# EasyEDA Pro project ProProject_Hauptplatine_ESP32.epro, board PCB1
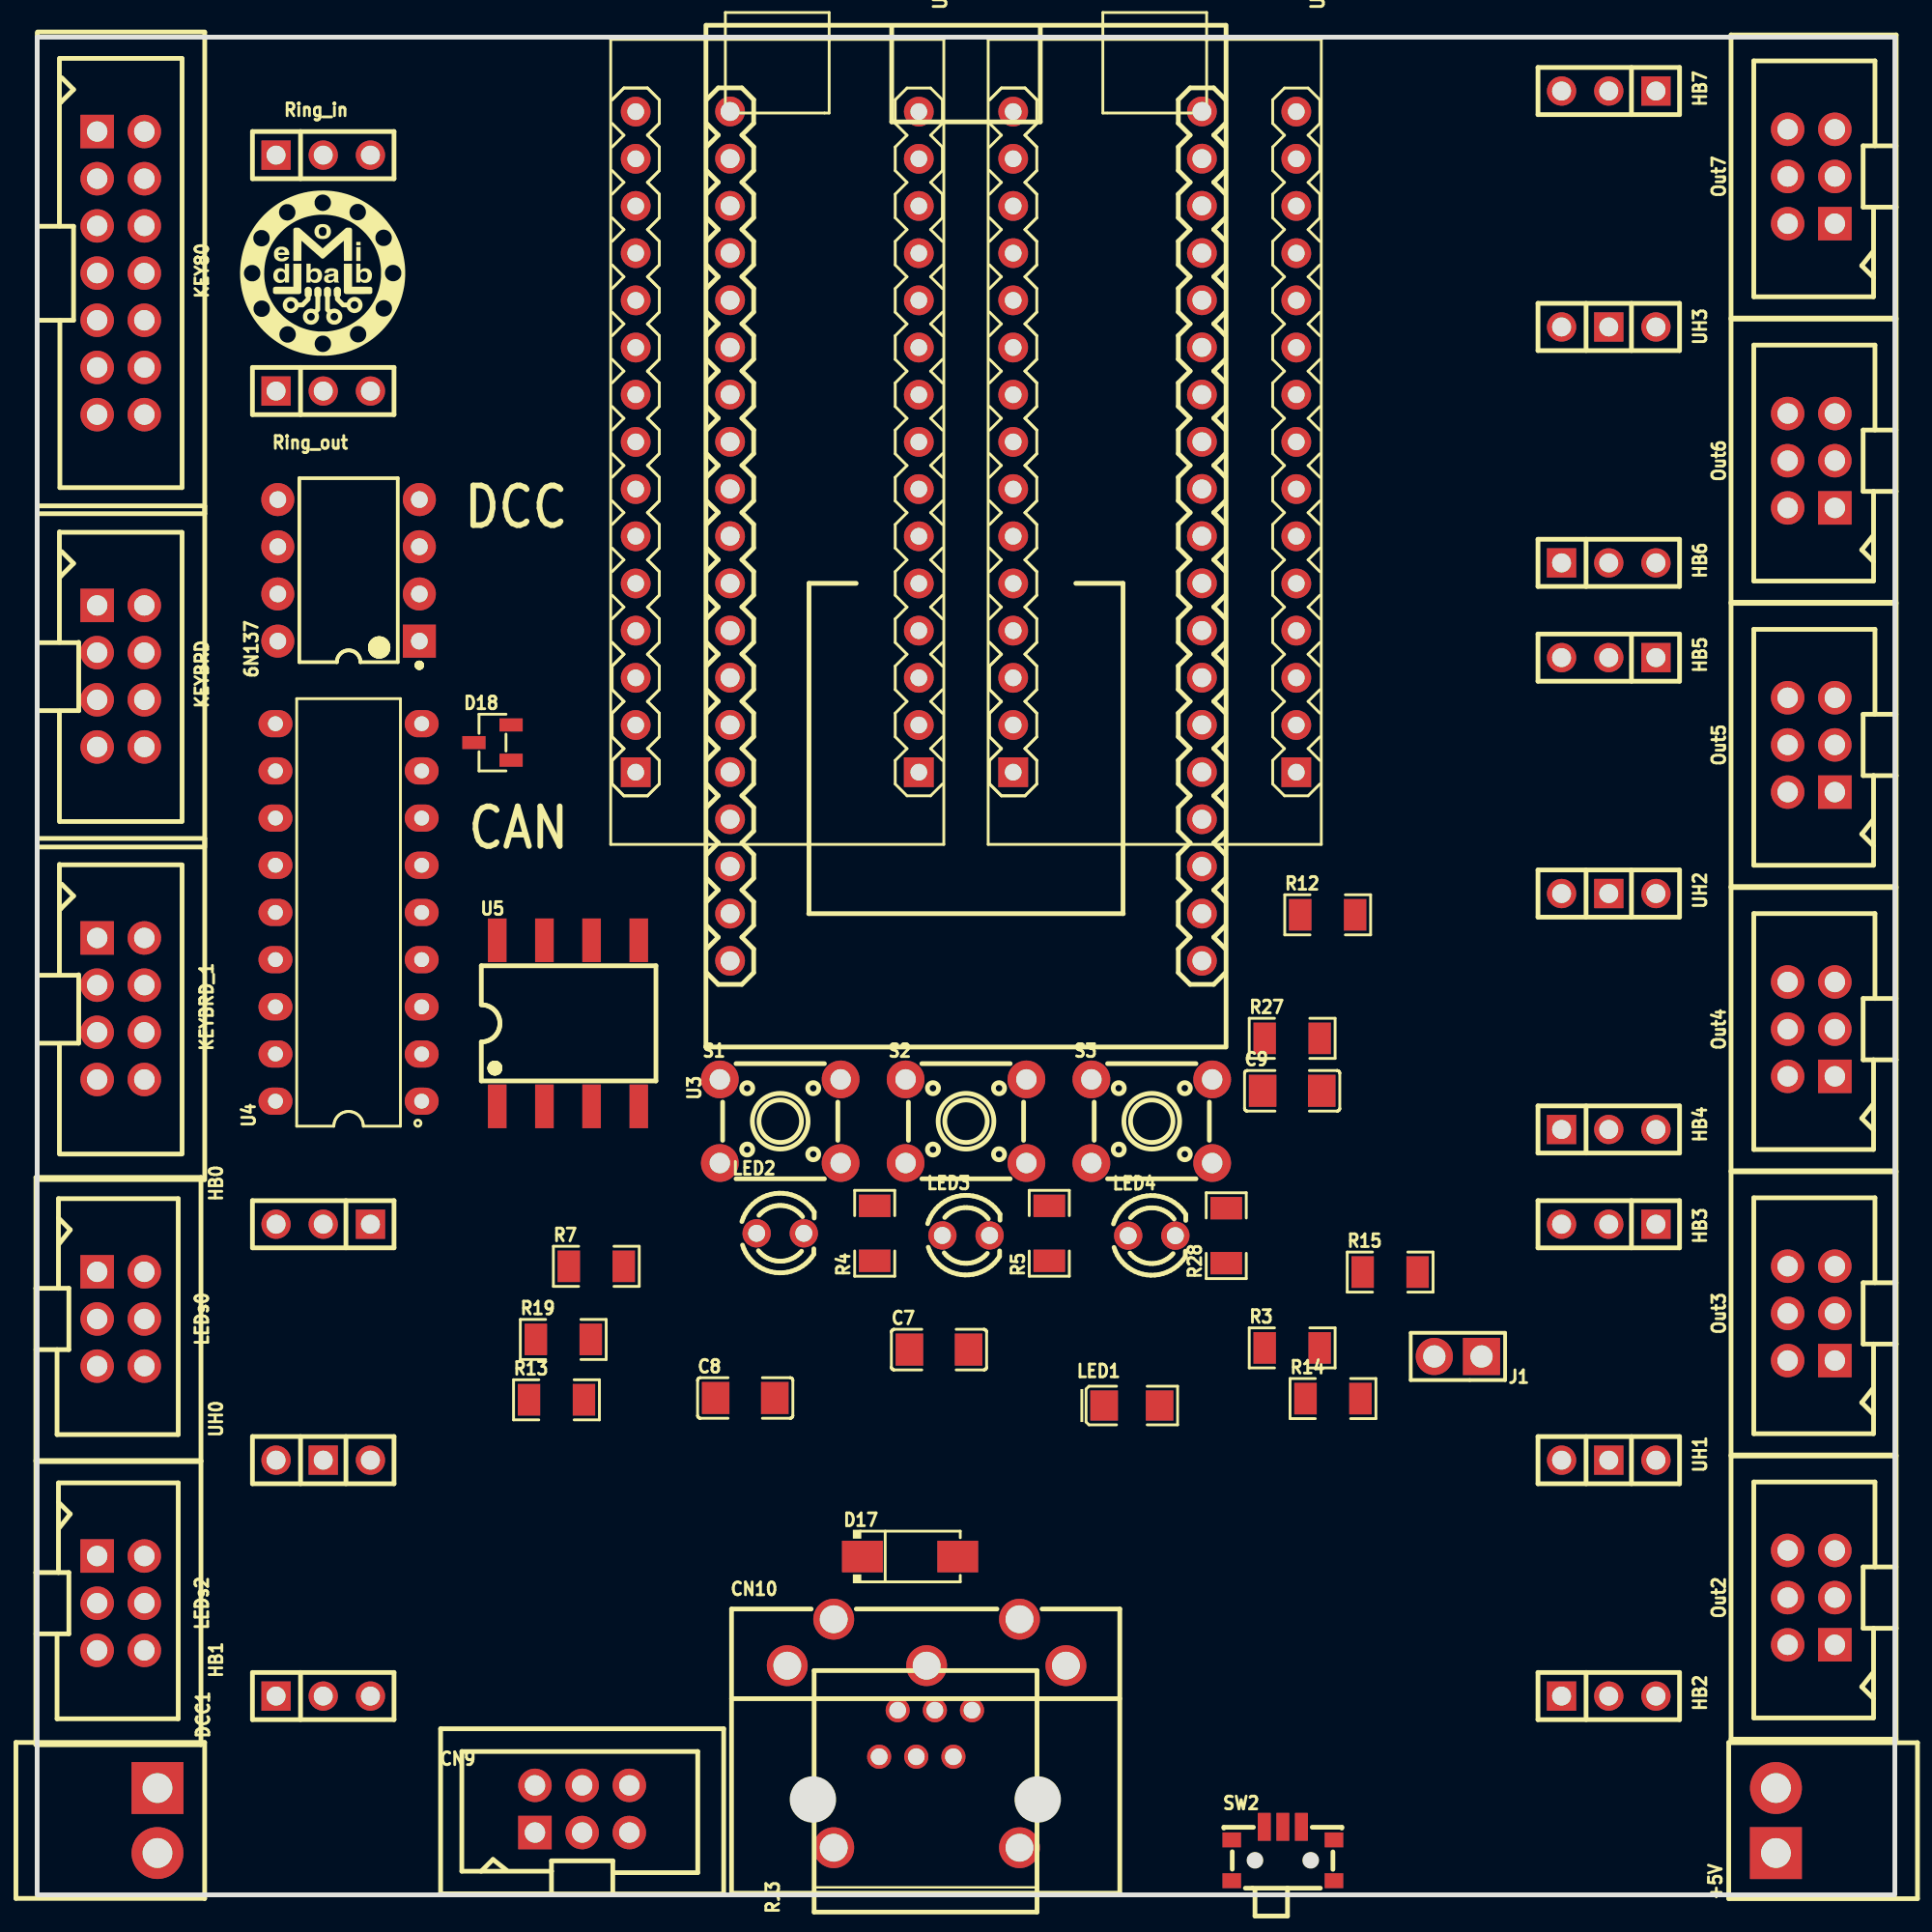
[diagram p12: board, top side]
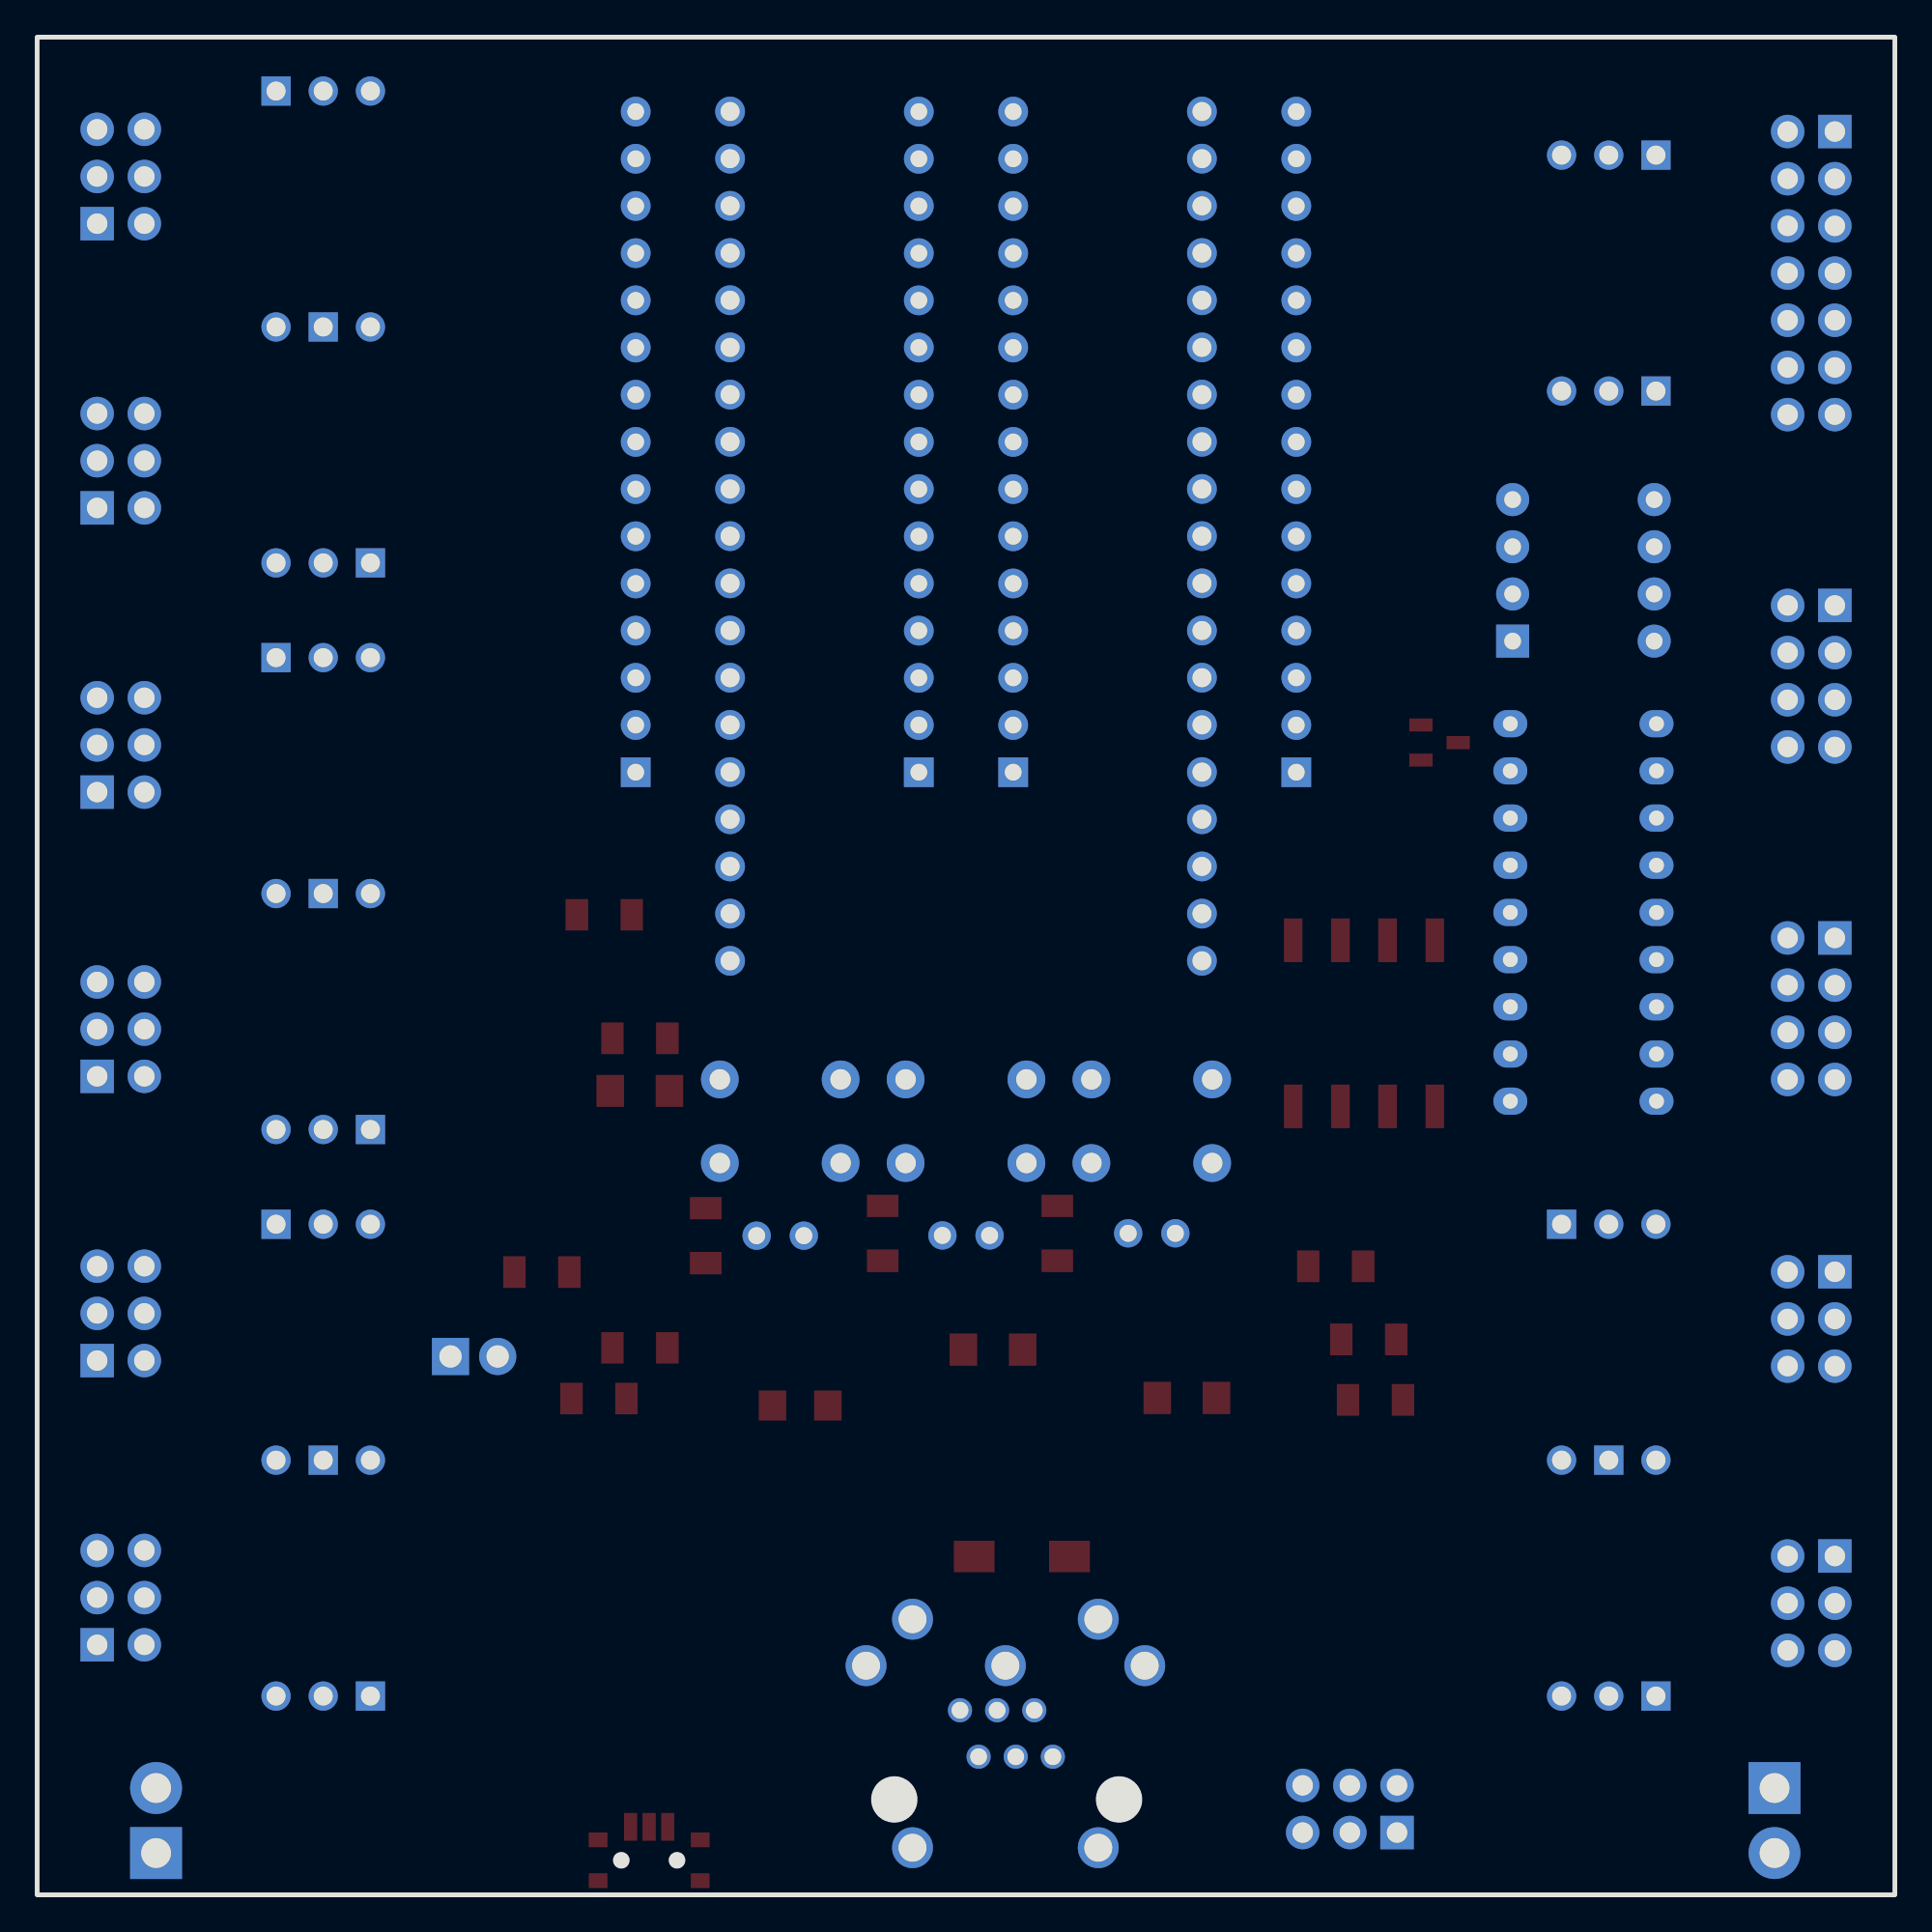
[diagram p13: board, bottom side, seen from below]

Outline 100 x 100 mm; copper layers: Top Layer, Bottom Layer. Coordinates in mm from the lower left corner of the outline.
Outline path: rectangle 0,100 100,0
Stack: Top Layer 0.035mm / Dielectric1 1.51mm FR4 er 4.5 / Bottom Layer 0.035mm

## Design rules (mm)
template: copperThickness1oz
spacing copperThickness1oz (default): track to track 0.132, other pairs 0.152 to 0.3
spacing copperThickness2oz: track to track 0.203, other pairs 0.152 to 0.3
track width copperThickness1oz (default): min 0.127, default 0.254, max 2.54
track width copperThickness2oz: min 0.203, default 0.254, max 2.54
differential pair differentialPair (default): width min 0.127, default 0.254, max 2.54; gap min 0.152, default 0.152
via viaSize (default): diameter min 0.5, default 0.61, max 10; hole min 0.3, default 0.305, max 6.299

## Placement (name value [footprint] x y rotation side)
6N137  6N137  [DIP-8_L9.8-W6.6-P2.54-LS7.6-BL]  16.76 71.3 90 top
+5V  DB2ERC-3.5-2P-GN  [CONN-TH_2P-P3.50_DB2ERC-3.5-2P]  93.6 4 90 top
C7  1uF  [C1206]  48.55 29.35 0 top
C8  1uF  [C1206]  38.12 26.75 0 top
C9  1uF  [C1206]  67.56 43.28 0 top
CN9  BH254V-6P  [IDC-TH_6P-P2.54-V-R2-C3-S2.54]  29.34 4.62 0 top
CN10  DIN-504B-M10  [CONN-TH_DIN-504B-M10]  47.88 8.69 0 top
D17  SS14  [SMA_L4.2-W2.6-LS5.3-RD]  46.99 18.21 0 top
D18  PESD2CAN,215  [SOT-23-3_L2.9-W1.3-P1.90-LS2.4-BR]  24.51 62.03 0 top
DCC1  DB2ERC-3.5-2P-GN  [CONN-TH_2P-P3.50_DB2ERC-3.5-2P]  6.48 4 270 top
HB0  PM2.54-1*3  [HDR-TH_3P-P2.54-V-F]  15.4 36.1 180 top
HB1  PM2.54-1*3  [HDR-TH_3P-P2.54-V-F]  15.4 10.7 0 top
HB2  PM2.54-1*3  [HDR-TH_3P-P2.54-V-F]  84.6 10.7 0 top
HB3  PM2.54-1*3  [HDR-TH_3P-P2.54-V-F]  84.6 36.1 180 top
HB4  PM2.54-1*3  [HDR-TH_3P-P2.54-V-F]  84.6 41.2 0 top
HB5  PM2.54-1*3  [HDR-TH_3P-P2.54-V-F]  84.6 66.6 180 top
HB6  PM2.54-1*3  [HDR-TH_3P-P2.54-V-F]  84.6 71.7 0 top
HB7  PM2.54-1*3  [HDR-TH_3P-P2.54-V-F]  84.6 97.1 180 top
J1  day/night  [HDR-TH_2P-P2.54-V-M]  76.48 28.98 180 top
KEY80  KEY80  [IDC-TH_14P-P2.54-V-R2-C7-S2.54]  4.5 87.3 270 top
KEYBRD  KEYBRD  [IDC-TH_8P-P2.54-V-R2-C4-S2.54]  4.5 65.6 270 top
KEYBRD_1  KEYBRD_1  [IDC-TH_8P-P2.54-V-R2-C4-S2.54]  4.5 47.7 270 top
LED1  Heartbeat  [LED1206-R-RD_GREEN]  58.93 26.34 0 top
LED2  y  [LED-TH_BD3.0-P2.54-FD]  40 35.61 0 top
LED3  w  [LED-TH_BD3.0-P2.54-FD]  50 35.5 0 top
LED4  b  [LED-TH_BD3.0-P2.54-FD]  60 35.48 0 top
LEDs0  BH254V-6P  [IDC-TH_6P-P2.54-V-R2-C3-S2.54]  4.5 31 270 top
LEDs2  BH254V-6P  [IDC-TH_6P-P2.54-V-R2-C3-S2.54]  4.5 15.7 270 top
Out2  BH254V-6P  [IDC-TH_6P-P2.54-V-R2-C3-S2.54]  95.5 16 90 top
Out3  BH254V-6P  [IDC-TH_6P-P2.54-V-R2-C3-S2.54]  95.5 31.3 90 top
Out4  BH254V-6P  [IDC-TH_6P-P2.54-V-R2-C3-S2.54]  95.5 46.6 90 top
Out5  BH254V-6P  [IDC-TH_6P-P2.54-V-R2-C3-S2.54]  95.5 61.9 90 top
Out6  BH254V-6P  [IDC-TH_6P-P2.54-V-R2-C3-S2.54]  95.5 77.2 90 top
Out7  BH254V-6P  [IDC-TH_6P-P2.54-V-R2-C3-S2.54]  95.5 92.5 90 top
R3  470Ω  [R1206]  67.56 29.44 0 top
R4  470Ω  [R1206]  45.09 35.61 90 top
R5  1kΩ  [R1206]  54.48 35.61 90 top
R7  4.7kΩ  [R1206]  30.1 33.83 0 top
R12  100Ω  [R1206]  69.47 52.76 0 top
R13  4.7kΩ  [R1206]  27.96 26.65 0 top
R14  22kΩ  [R1206]  69.75 26.71 0 top
R15  100Ω  [R1206]  72.83 33.52 0 top
R19  1kΩ  [R1206]  28.32 29.9 0 top
R27  22kΩ  [R1206]  67.56 46.11 0 top
R28  1kΩ  [R1206]  64.01 35.48 90 top
Ring_in  PM2.54-1*3  [HDR-TH_3P-P2.54-V-F]  15.4 93.65 0 top
Ring_out  PM2.54-1*3  [HDR-TH_3P-P2.54-V-F]  15.4 80.95 0 top
RJ3  DS1133-S60BPX  [RJ11-TH_DS1133-S60BPX]  47.82 8.69 90 top
S1  K2-1102DP-X4SW-04  [KEY-TH_4P-L6.2-W6.2-P4.50-LS6.5]  40 41.64 0 top
S2  K2-1102DP-X4SW-04  [KEY-TH_4P-L6.2-W6.2-P4.50-LS6.5]  50 41.64 0 top
S3  K2-1102DP-X4SW-04  [KEY-TH_4P-L6.2-W6.2-P4.50-LS6.5]  60 41.64 0 top
SW2  MINI MSK12CO2  [SW-SMD_MSK12CO2]  67.06 2.21 0 top
U1  ARDUINO_DCC  [COMM-TH_ARDUINO_NANO]  60.16 78.21 270 top
U2  ARDUINO_LED  [COMM-TH_ARDUINO_NANO]  39.84 78.21 270 top
U3  ESP32-DevKitC  [BULETM-SMD_ESP32-DEVKITC]  50 73.14 90 top
U4  MCP2515-I/P  [PDIP-18_L22.9-W6.4-P2.54-LS7.9-BL]  16.76 52.88 90 top
U5  ISO1050DUBR  [SOIC-8_L9.3-W6.6-P2.54-LS10.4-BL]  28.57 46.91 0 top
UH0  PM2.54-1*3  [hdr-th_3p-p2.54-v-f]  15.4 23.4 0 top
UH1  PM2.54-1*3  [hdr-th_3p-p2.54-v-f]  84.6 23.4 0 top
UH2  PM2.54-1*3  [hdr-th_3p-p2.54-v-f]  84.6 53.9 0 top
UH3  PM2.54-1*3  [hdr-th_3p-p2.54-v-f]  84.6 84.4 0 top

## Footprints (pads in the part's own frame, mm; a bottom-side part is the same pattern mirrored in y, then rotated)
BULETM-SMD_ESP32-DEVKITC
  round 1.6 hole 1.02: 1(-22.86,-12.7) 2(-20.32,-12.7) 3(-17.78,-12.7) 4(-15.24,-12.7) 5(-12.7,-12.7) 6(-10.16,-12.7) 7(-7.62,-12.7) 8(-5.08,-12.7) 9(-2.54,-12.7) 10(0,-12.7) 11(2.54,-12.7) 12(5.08,-12.7) 13(7.62,-12.7) 14(10.16,-12.7) 15(12.7,-12.7) 16(15.24,-12.7) 17(17.78,-12.7) 18(20.32,-12.7) 19(22.86,-12.7) 20(-22.86,12.7) 21(-20.32,12.7) 22(-17.78,12.7) 23(-15.24,12.7) 24(-12.7,12.7) 25(-10.16,12.7) 26(-7.62,12.7) 27(-5.08,12.7) 28(-2.54,12.7) 29(0,12.7) 30(2.54,12.7) 31(5.08,12.7) 32(7.62,12.7) 33(10.16,12.7) 34(12.7,12.7) 35(15.24,12.7) 36(17.78,12.7) 37(20.32,12.7) 38(22.86,12.7)
C1206
  rect 1.485x1.728 smd: 1(-1.593,0) 2(1.593,0)
COMM-TH_ARDUINO_NANO
  rect 1.6x1.6 hole 0.9: 1(17.78,7.62) 30(17.78,-7.62)
  round 1.6 hole 0.9: 2(15.24,7.62) 3(12.7,7.62) 4(10.16,7.62) 5(7.62,7.62) 6(5.08,7.62) 7(2.54,7.62) 8(0,7.62) 9(-2.54,7.62) 10(-5.08,7.62) 11(-7.62,7.62) 12(-10.16,7.62) 13(-12.7,7.62) 14(-15.24,7.62) 15(-17.78,7.62) 16(-17.78,-7.62) 17(-15.24,-7.62) 18(-12.7,-7.62) 19(-10.16,-7.62) 20(-7.62,-7.62) 21(-5.08,-7.62) 22(-2.54,-7.62) 23(0,-7.62) 24(2.54,-7.62) 25(5.08,-7.62) 26(7.62,-7.62) 27(10.16,-7.62) 28(12.7,-7.62) 29(15.24,-7.62)
CONN-TH_2P-P3.50_DB2ERC-3.5-2P
  round 2.794 hole 1.6: 1(1.75,0)
  rect 2.794x2.794 hole 1.6: 2(-1.75,0)
CONN-TH_DIN-504B-M10
  round 2.2 hole 1.5: 1(-7.5,3.65) 2(-5,6.15) 3(0,3.65) 4(5,6.15) 5(7.5,3.65) 6(-5,-6.15) 7(5,-6.15)
DIP-8_L9.8-W6.6-P2.54-LS7.6-BL
  rect 1.778x1.778 hole 0.9: 1(-3.81,-3.81)
  round 1.778 hole 0.9: 2(-1.27,-3.81) 3(1.27,-3.81) 4(3.81,-3.81) 5(3.81,3.81) 6(1.27,3.81) 7(-1.27,3.81) 8(-3.81,3.81)
HDR-TH_2P-P2.54-V-M
  rect 2x2 hole 1.2: 1(-1.27,0)
  round 2 hole 1.2: 2(1.27,0)
hdr-th_3p-p2.54-v-f
  round 1.575 hole 1.02: 1(-2.54,0) 3(2.54,0)
  rect 1.575x1.575 hole 1.02: 2(0,0)
HDR-TH_3P-P2.54-V-F
  rect 1.575x1.575 hole 1.02: 1(-2.54,0)
  round 1.575 hole 1.02: 2(0,0) 3(2.54,0)
IDC-TH_6P-P2.54-V-R2-C3-S2.54
  rect 1.8x1.8 hole 1.1: 1(-2.54,-1.27)
  round 1.8 hole 1.1: 2(-2.54,1.27) 3(0,-1.27) 4(0,1.27) 5(2.54,-1.27) 6(2.54,1.27)
IDC-TH_8P-P2.54-V-R2-C4-S2.54
  rect 1.801x1.801 hole 1.1: 1(-3.81,-1.27)
  round 1.801 hole 1.1: 2(-3.81,1.27) 3(-1.27,-1.27) 4(-1.27,1.27) 5(1.27,-1.27) 6(1.27,1.27) 7(3.81,-1.27) 8(3.81,1.27)
IDC-TH_14P-P2.54-V-R2-C7-S2.54
  rect 1.8x1.8 hole 1.1: 1(-7.62,-1.27)
  round 1.8 hole 1.1: 2(-7.62,1.27) 3(-5.08,-1.27) 4(-5.08,1.27) 5(-2.54,-1.27) 6(-2.54,1.27) 7(0,-1.27) 8(0,1.27) 9(2.54,-1.27) 10(2.54,1.27) 11(5.08,-1.27) 12(5.08,1.27) 13(7.62,-1.27) 14(7.62,1.27)
KEY-TH_4P-L6.2-W6.2-P4.50-LS6.5
  round 2.032 hole 1.1: 1(-3.251,2.251) 2(3.251,2.251) 3(-3.251,-2.251) 4(3.251,-2.251)
LED1206-R-RD_GREEN
  rect 1.485x1.62 smd: 1(1.492,0) 2(-1.492,0)
LED-TH_BD3.0-P2.54-FD
  round 1.524 hole 0.914: 1(-1.27,0) 2(1.27,0)
PDIP-18_L22.9-W6.4-P2.54-LS7.9-BL
  oval 1.462x1.827 hole 0.8: 1(-10.16,-3.935) 2(-7.62,-3.935) 3(-5.08,-3.935) 4(-2.54,-3.935) 5(0,-3.935) 6(2.54,-3.935) 7(5.08,-3.935) 8(7.62,-3.935) 9(10.16,-3.935) 10(10.16,3.935) 11(7.62,3.935) 12(5.08,3.935) 13(2.54,3.935) 14(0,3.935) 15(-2.54,3.935) 16(-5.08,3.935) 17(-7.62,3.935) 18(-10.16,3.935)
R1206
  rect 1.208x1.701 smd: 1(-1.479,0) 2(1.479,0)
RJ11-TH_DS1133-S60BPX
  round 1.3 hole 0.9: 1(1.251,-2.499) 2(-1.251,-1.498) 3(1.251,-0.5) 4(-1.251,0.5) 5(1.251,1.501) 6(-1.251,2.499)
SMA_L4.2-W2.6-LS5.3-RD
  rect 2.2x1.7 smd: 1(-2.566,0) 2(2.566,0)
SOIC-8_L9.3-W6.6-P2.54-LS10.4-BL
  rect 1x2.35 smd: 1(-3.81,-4.471) 2(-1.27,-4.471) 3(1.27,-4.471) 4(3.81,-4.471) 5(3.81,4.471) 6(1.27,4.471) 7(-1.27,4.471) 8(-3.81,4.471)
SOT-23-3_L2.9-W1.3-P1.90-LS2.4-BR
  rect 1.25x0.7 smd: 1(1,-0.95) 2(1,0.95) 3(-1,0)
SW-SMD_MSK12CO2
  rect 0.7x1.5 smd: 1(-1,1.45) 2(0,1.45) 3(1,1.45)
  rect 1x0.8 smd: 4(-2.75,0.75) 4(-2.75,-1.45) 5(2.75,0.75) 5(2.75,-1.45)

## Nets
3V3: U3.1
+5V: 6N137.8 +5V.1 KEY80.13 KEYBRD.3 KEYBRD_1.3 LEDs0.1 LEDs2.1 Out2.1 Out3.1 Out4.1 Out5.1 Out6.1 Out7.1 R13.2 R14.1 R27.1 Ring_in.1 Ring_out.1 UH0.2 UH1.2 UH2.2 UH3.2
GND: 6N137.5 +5V.2 C7.1 C8.1 C9.1 J1.1 KEY80.14 KEYBRD.4 KEYBRD_1.2 KEYBRD_1.4 LED1.2 LED2.2 LED3.2 LED4.2 LEDs0.2 LEDs0.3 LEDs2.2 LEDs2.3 Out2.2 Out2.3 Out3.2 Out3.3 Out4.2 Out4.3 Out5.2 Out5.3 Out6.2 Out6.3 Out7.2 Out7.3 R7.1 Ring_in.3 Ring_out.3 S1.1 S1.2 S2.1 S2.2 S3.1 S3.2 U3.20 UH0.1 UH0.3 UH1.1 UH1.3 UH2.1 UH2.3 UH3.1 UH3.3
D7: KEY80.2 S1.3 S1.4 U2.10
D8: KEY80.3 S2.3 S2.4 U2.11
D9: KEY80.4 S3.3 S3.4 U2.12
D10: KEY80.5 U2.13
DCC/SX: 6N137.6 U1.5
OUT5: KEY80.7
RESET_K0: KEY80.10 KEYBRD.6 KEYBRD_1.6 R3.2 U2.22
$1N1187: DCC1.1 R19.2
$1N1188: D17.1 DCC1.2
$1N1189: 6N137.2 R19.1
$1N1190: 6N137.3 D17.2
$1N1986: KEYBRD.2 KEYBRD_1.1 R15.1
$1N2005: C9.2 KEY80.12 R15.2 R27.2 U2.24
$1N2586: KEY80.8 U1.20 U2.20
$1N2626: KEY80.9 KEYBRD.7 KEYBRD_1.7 R7.2 U2.21
$1N2750: KEY80.11 KEYBRD.1 R12.1
$1N3086: KEYBRD.5 U2.19
$1N3216: C7.2 KEYBRD_1.8 R14.2 U2.25
$1N3936: C8.2 J1.2 R13.1 SW2.3
$1N5216: LED2.1 R4.1
$1N5296: LED3.1 R5.2
$1N5376: LED4.1 R28.2
$1N7443: LED1.1 R3.1
$1N11896: HB1.2 LEDs2.6
$1N11901: HB1.3 LEDs2.5
$1N11909: HB0.2 LEDs0.6
$1N11921: HB0.3 LEDs0.5
$1N12006: HB2.3 Out2.5
$1N12011: HB3.3 Out3.5
$1N12461: HB3.2 Out3.6
$1N12464: HB4.2 Out4.6
$1N12467: HB4.3 Out4.5
$1N12470: HB5.3 Out5.5
$1N12476: HB5.2 Out5.6
$1N12479: HB6.3 Out6.5
$1N12482: HB6.2 Out6.6
$1N12485: HB7.3 Out7.5
$1N12491: HB7.2 Out7.6
$1N12927: HB2.2 Out2.6
$1N14033: HB4.1 U2.16 U3.28
$1N15290: HB6.1 KEY80.6 U2.14 U3.21
$1N15301: HB5.1 U2.15 U3.27
$1N15328: HB7.1 R28.1 U2.8 U3.33
$1N15339: HB3.1 R5.1 U2.7 U3.12
$1N15360: HB2.1 R4.2 U2.6 U3.31
$1N15410: HB0.1 Ring_out.2
$1N15431: R12.2 U2.23 U3.7
$1N15453: HB1.1 KEY80.1 U2.5 U3.30
$1N15556: Ring_in.2 U2.9 U3.11
$1N15628: KEYBRD.8 KEYBRD_1.5 SW2.1
$1N15658: SW2.2 U2.26

Pads without a net: 6N137 1 4 7; CN9 1 2 3 4 5 6; CN10 1 2 3 4 5 6 7; D18 1 2 3; LEDs0 4; LEDs2 4; Out2 4; Out3 4; Out4 4; Out5 4; Out6 4; Out7 4; RJ3 1 2 3 4 5 6; SW2 4 5; U1 1 2 3 4 6 7 8 9 10 11 12 13 14 15 16 17 18 19 21 22 23 24 25 26 27 28 29 30; U2 1 2 3 4 17 18 27 28 29 30; U3 2 3 4 5 6 8 9 10 13 14 15 16 17 18 19 22 23 24 25 26 29 32 34 35 36 37 38; U4 1 2 3 4 5 6 7 8 9 10 11 12 13 14 15 16 17 18; U5 1 2 3 4 5 6 7 8

## Text on the board
Top Silkscreen Layer: DCC | CAN
